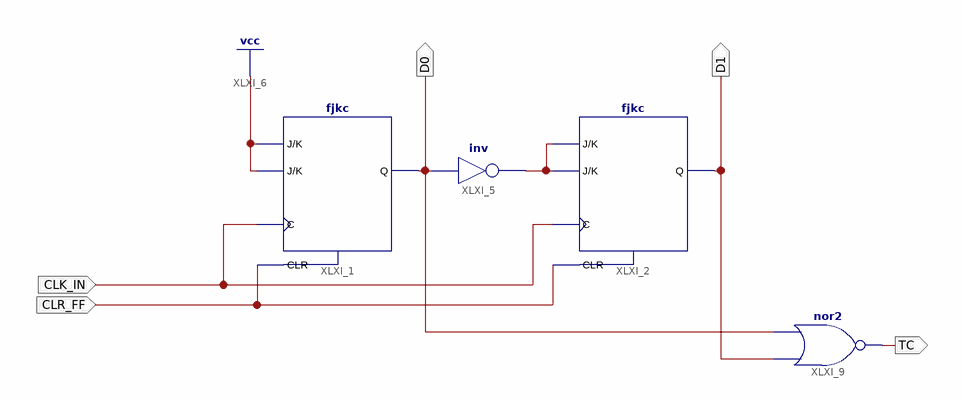
[diagram p0: schematic sheet 1]
// Xilinx ISE schematic Counter_Down_3_0_withTC.sch (spartan6) as structural Verilog: 4 symbols, 5 ports
module Counter_Down_3_0_withTC (
  input  CLK_IN,
  input  CLR_FF,
  output D0,
  output D1,
  output TC
);

  wire XLXN_10;

  fjkc XLXI_1 (.C(CLK_IN), .CLR(CLR_FF), .J(1'b1), .K(1'b1), .Q(D0));
  fjkc XLXI_2 (.C(CLK_IN), .CLR(CLR_FF), .J(XLXN_10), .K(XLXN_10), .Q(D1));
  not XLXI_5 (XLXN_10, D0);
  nor XLXI_9 (TC, D1, D0);
endmodule
